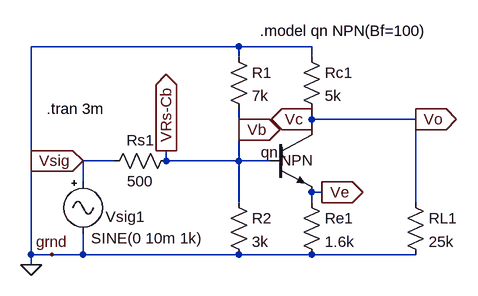
[diagram p0: schematic Q1b no C.asc]
Q1b no C.asc, the LTspice schematic file:
Version 4
SHEET 1 880 680
WIRE 48 -32 -272 -32
WIRE 160 -32 48 -32
WIRE 48 -16 48 -32
WIRE 160 -16 160 -32
WIRE 160 80 160 64
WIRE 320 80 160 80
WIRE 48 96 48 64
WIRE 160 96 160 80
WIRE -144 144 -192 144
WIRE -64 144 -64 128
WIRE 48 144 48 96
WIRE 48 144 -64 144
WIRE 96 144 48 144
WIRE -192 176 -192 144
WIRE 176 192 160 192
WIRE 48 208 48 144
WIRE 160 208 160 192
WIRE 320 208 320 80
WIRE -272 288 -272 -32
WIRE -240 288 -272 288
WIRE -192 288 -192 256
WIRE -192 288 -240 288
WIRE 48 288 -192 288
WIRE 160 288 48 288
WIRE 320 288 160 288
WIRE -272 304 -272 288
FLAG -272 304 0
FLAG -64 128 VRs-Cb
IOPIN -64 128 Out
FLAG -192 144 Vsig
IOPIN -192 144 In
FLAG 48 96 Vb
IOPIN 48 96 Out
FLAG 160 80 Vc
IOPIN 160 80 Out
FLAG 176 192 Ve
IOPIN 176 192 Out
FLAG -240 288 grnd
FLAG 320 80 Vo
IOPIN 320 80 Out
SYMBOL res 144 -32 R0
SYMATTR InstName Rc1
SYMATTR Value 5k
SYMBOL res 32 -32 R0
SYMATTR InstName R1
SYMATTR Value 7k
SYMBOL res -160 160 R270
WINDOW 0 32 56 VTop 2
WINDOW 3 0 56 VBottom 2
SYMATTR InstName Rs1
SYMATTR Value 500
SYMBOL res 32 192 R0
SYMATTR InstName R2
SYMATTR Value 3k
SYMBOL res 144 192 R0
SYMATTR InstName Re1
SYMATTR Value 1.6k
SYMBOL res 304 192 R0
SYMATTR InstName RL1
SYMATTR Value 25k
SYMBOL npn 96 96 R0
WINDOW 0 -14 35 Left 2
WINDOW 3 16 47 Left 2
SYMATTR InstName qn1
SYMBOL signal -192 160 R0
WINDOW 0 35 70 Left 2
WINDOW 3 12 103 Left 2
WINDOW 123 0 0 Left 2
WINDOW 39 0 0 Left 2
SYMATTR InstName Vsig1
SYMATTR Value SINE(0 10m 1k)
TEXT 80 -56 Left 2 !.model qn NPN(Bf=100)
TEXT -248 64 Left 2 !.tran 3m

The netlist it stands for:
* Q1b no C.asc
Rc1 0 Vo 5k
R1 0 Vb 7k
Rs1 Vsig Vb 500
R2 Vb 0 3k
Re1 Ve 0 1.6k
RL1 Vo 0 25k
qn1 Vo Vb Ve 0 NPN
Vsig1 Vsig 0 SINE(0 10m 1k)
.model NPN NPN
.model PNP PNP
.lib standard.bjt
.model qn NPN(Bf=100)
.tran 3m
.backanno
.end